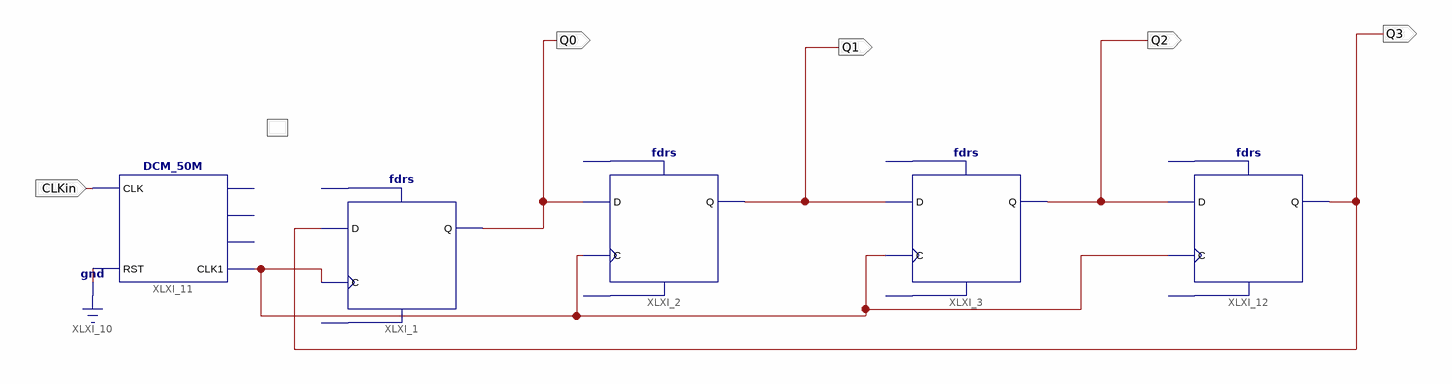
[diagram p0: schematic sheet 1]
// Xilinx ISE schematic experiment8_real.sch (spartan3e) as structural Verilog: 5 symbols, 5 ports
module experiment8_real (
  input  CLKin,
  output Q2,
  output Q1,
  output Q0,
  output Q3
);

  wire XLXN_18;

  fdrs XLXI_1 (.C(XLXN_18), .D(Q3), .Q(Q0));  // open: R, S
  fdrs XLXI_3 (.C(XLXN_18), .D(Q1), .Q(Q2));  // open: R, S
  fdrs XLXI_2 (.C(XLXN_18), .D(Q0), .Q(Q1));  // open: R, S
  DCM_50M XLXI_11 (.CLK(CLKin), .RST(1'b0), .CLK1(XLXN_18));  // open: CLK1M, CLK10k, CLK1k
  fdrs XLXI_12 (.C(XLXN_18), .D(Q2), .Q(Q3));  // open: R, S
endmodule
